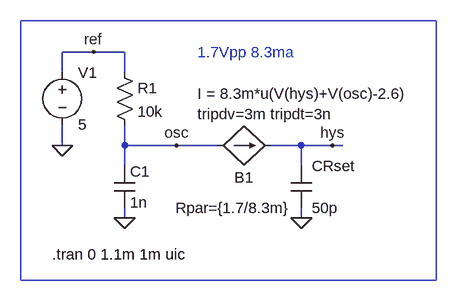
[diagram p0: schematic oscillator_test_B.asc]
oscillator_test_B.asc, the LTspice schematic file:
Version 4
SHEET 1 1068 680
WIRE 832 176 832 144
WIRE 832 144 784 144
WIRE 832 256 832 240
WIRE 704 144 640 144
WIRE 832 144 880 144
WIRE 880 144 896 144
WIRE 560 240 560 256
WIRE 560 176 560 144
WIRE 560 32 560 0
WIRE 560 0 512 0
WIRE 464 144 464 112
WIRE 464 32 464 0
WIRE 560 144 560 112
WIRE 640 144 560 144
WIRE 512 0 464 0
FLAG 640 144 osc
FLAG 880 144 hys
FLAG 560 256 0
FLAG 464 144 0
FLAG 832 256 0
FLAG 512 0 ref
SYMBOL bi 704 144 R270
WINDOW 0 -34 40 VBottom 0
WINDOW 3 80 -32 VRight 0
WINDOW 123 48 -32 VRight 0
SYMATTR InstName B1
SYMATTR Value I = 8.3m*u(V(hys)+V(osc)-2.6)
SYMATTR Value2 tripdv=3m tripdt=3n
SYMBOL cap 816 176 R0
WINDOW 0 32 0 Left 0
WINDOW 3 32 64 Left 0
WINDOW 39 0 64 Right 0
SYMATTR InstName CRset
SYMATTR Value 50p
SYMATTR SpiceLine Rpar={1.7/8.3m}
SYMBOL cap 544 176 R0
SYMATTR InstName C1
SYMATTR Value 1n
SYMBOL res 544 16 R0
SYMATTR InstName R1
SYMATTR Value 10k
SYMBOL voltage 464 16 R0
SYMATTR InstName V1
SYMATTR Value 5
TEXT 672 0 Left 0 ;1.7Vpp 8.3ma
TEXT 448 312 Left 0 !.tran 0 1.1m 1m uic
RECTANGLE Normal 1040 352 400 -48

The netlist it stands for:
* oscillator_test_B.asc
B1 osc hys I = 8.3m*u(V(hys)+V(osc)-2.6) tripdv=3m tripdt=3n
CRset hys 0 50p Rpar={1.7/8.3m}
C1 osc 0 1n
R1 ref osc 10k
V1 ref 0 5
* 1.7Vpp 8.3ma
.tran 0 1.1m 1m uic
.backanno
.end